# EAGLE design PayloadV13 (EAGLE 7.3.0)
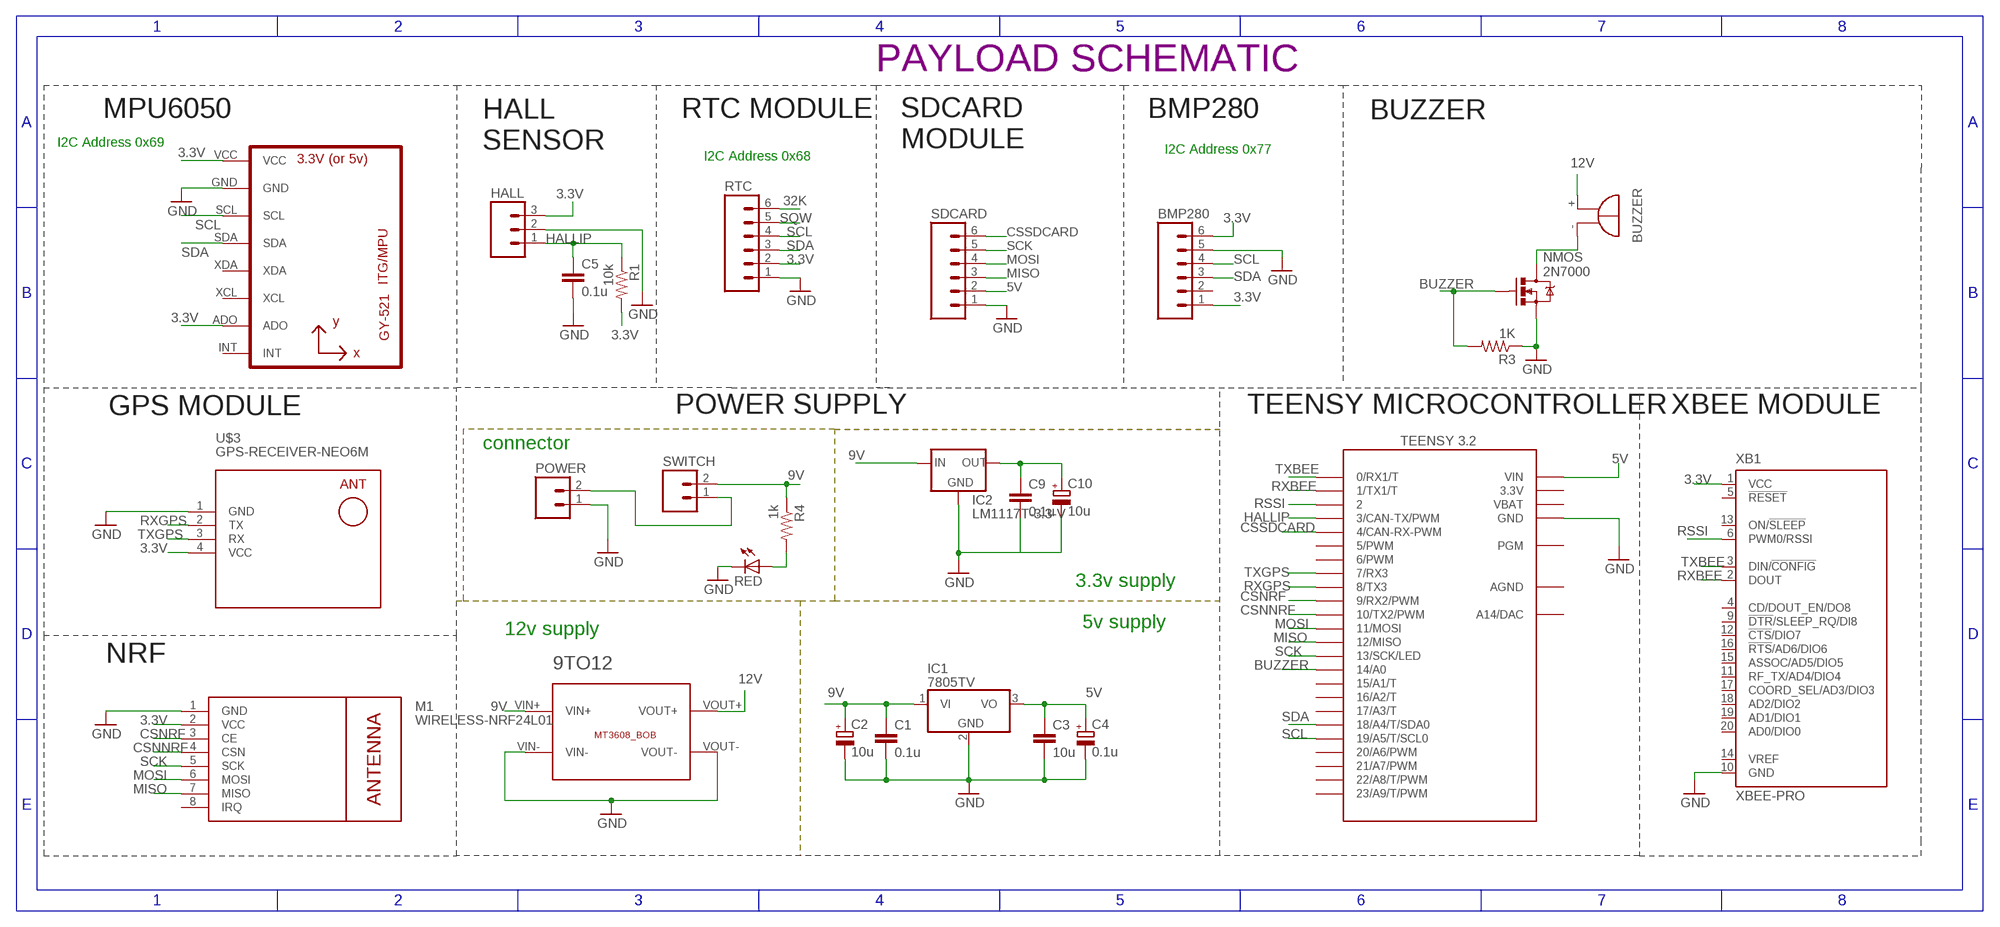
[diagram p0: schematic, sheet 1]

## Parts
9TO12  BREAKOUTS_MT3608_BOB  [BREAKOUTS_MT3608_BOB]
BMP280  M06  [06P]
C1  0.1u  C-EU025-025X050  [C025-025X050]
C2  10u  CPOL-EUE2.5-6  [E2,5-6]
C3  10u  C-EU025-025X050  [C025-025X050]
C4  0.1u  CPOL-EUE2.5-6  [E2,5-6]
C5  0.1u  C-EU025-025X050  [C025-025X050]
C9  0.1u  C-EU025-025X050  [C025-025X050]
C10  10u  CPOL-EUE2.5-6  [E2,5-6]
HALL  M03  [03P]
IC1  7805TV  [TO220V]
IC2  LM1117T-3.3-V  [TO220V]
M1  WIRELESS-NRF24L01  [WIRELESS-NRF24L01]
POWER  CEDT_JANUARY_2015_V5_M02  [CEDT_JANUARY_2015_V5_02P]
Q1  SPARKFUN-DISCRETESEMI_MOSFET-NCHANNEL2N7000  [SPARKFUN-DISCRETESEMI_TO-92]
R1  10k  R-US_0204/7  [0204/7]
R3  1K  R-US_0204/7  [0204/7]
R4  1k  R-US_0204/7  [0204/7]
RED  red  LED3MM  [LED3MM]
RTC  M06  [06P]
SDCARD  M06  [06P]
SG1  BUZZER_EB2209A  [BUZZER_EB2209A]
SWITCH  M02  [02P]
U1  GY-521MPU6050  [GY-521]
U$2  TEENSY_3.1-3.2_OUTER_ROW  [TEENSY_3.0-3.2&LC_OUTER_ROW]
U$3  GPS-RECEIVER-NEO6M  [GPS-RECEIVER-NEO6M]
XB1  XBEE-PRO  [XBEE-PRO]

## Nets
3.3V [power]: BMP280.1 BMP280.6 C9.1 C10.+ HALL.3 IC2.2(OUT) M1.2(VCC) R1.2 RTC.2 U1.ADO U1.VCC U$3.4(VCC) XB1.1(VCC)
5V [power]: C3.1 C4.+ IC1.3(VO) SDCARD.2 U$2.VIN
9V [power]: 9TO12.VIN+ C1.1 C2.+ IC1.1(VI) IC2.3(IN) R4.1 SWITCH.2
12V [power]: 9TO12.VOUT+ SG1.+
32K: RTC.6
BUZZER: Q1.2(G) R3.2 U$2.14/A0
CSNNRF: M1.4(CSN) U$2.10(10/TX2/PWM)
CSNRF: M1.3(CE) U$2.9(9/RX2/PWM)
CSSDCARD: SDCARD.6 U$2.4(4/CAN-RX-PWM)
GND [power]: 9TO12.VIN- 9TO12.VOUT- BMP280.5 C1.2 C2.- C3.2 C4.- C5.2 C9.2 C10.- HALL.2 IC1.2(GND) IC2.1(GND) M1.1(GND) POWER.1 Q1.1(S) R3.1 RED.K(C) RTC.1 SDCARD.1 U1.GND U$2.GND U$2.GND1(GND) U$3.1(GND) XB1.10(GND)
HALLIP: C5.1 HALL.1 R1.1 U$2.3(3/CAN-TX/PWM)
MISO: M1.7(MISO) SDCARD.3 U$2.12(12/MISO)
MOSI: M1.6(MOSI) SDCARD.4 U$2.11(11/MOSI)
N$1 [power]: POWER.2 SWITCH.1
N$2: R4.2 RED.A
N$3 [power]: Q1.3(D) SG1.-
RSSI: U$2.2 XB1.6(PWM0/RSSI)
RXBEE: U$2.1(1/TX1/T) XB1.2(DOUT)
RXGPS: U$2.8(8/TX3) U$3.2(TX)
SCK: M1.5(SCK) SDCARD.5 U$2.13(13/SCK/LED)
SCL: BMP280.4 RTC.4 U1.SCL U$2.19/A5(19/A5/T/SCL0)
SDA: BMP280.3 RTC.3 U1.SDA U$2.18/A4(18/A4/T/SDA0)
SQW: RTC.5
TXBEE: U$2.0(0/RX1/T) XB1.3(DIN/!CONFIG)
TXGPS: U$2.7(7/RX3) U$3.3(RX)
Unconnected: BMP280.2 M1.8(IRQ) U1.INT U1.XCL U1.XDA U$2.5(5/PWM) U$2.6(6/PWM) U$2.15/A1(15/A1/T) U$2.16/A2(16/A2/T) U$2.17/A3(17/A3/T) U$2.20/A6(20/A6/PWM) U$2.21/A7(21/A7/PWM) U$2.22/A8(22/A8/T/PWM) U$2.23/A9(23/A9/T/PWM) U$2.PGM U$2.RESET/DAC(A14/DAC) XB1.4(CD/DOUT_EN/DO8) XB1.5(!RESET) XB1.9(!DTR!/SLEEP_RQ/DI8) XB1.11(RF_TX/AD4/DIO4) XB1.12(!CTS!/DIO7) XB1.13(ON/!SLEEP) XB1.14(VREF) XB1.15(ASSOC/AD5/DIO5) XB1.16(!RTS!/AD6/DIO6) XB1.17(COORD_SEL/AD3/DIO3) XB1.18(AD2/DIO2) XB1.19(AD1/DIO1) XB1.20(AD0/DIO0)

## Notes on the sheet
- PAYLOAD SCHEMATIC
- MPU6050 | RTC MODULE | BMP280 | BUZZER
- I2C Address 0x69
- SDCARD
  MODULE
- HALL
  SENSOR
- I2C Address 0x77
- I2C Address 0x68
- GPS MODULE | POWER SUPPLY | TEENSY MICROCONTROLLER | XBEE MODULE
- connector
- 3.3v supply
- 5v supply
- 12v supply
- NRF

## Power pins joined to a net without a drawn wire
3.3V: U$2.3.3V U$2.3.3V1(3.3V)
AGND: U$2.AGND
VBAT: U$2.VBAT

## Library data of the parts
9TO12 = Cansat2019_3279_Container_v01:BREAKOUTS_MT3608_BOB
BMP280 RTC SDCARD = con-amp-quick:M06: AMP QUICK CONNECTOR; OC_FARNELL: unknown; OC_NEWARK: unknown
C1 C3 C5 C9 = resistor:C-EU: CAPACITOR, European symbol
C2 C4 C10 = rcl:CPOL-EU: POLARIZED CAPACITOR, European symbol
HALL = con-amp-quick:M03: AMP QUICK CONNECTOR; OC_FARNELL: unknown; OC_NEWARK: unknown
IC1 = linear:78*: Positive VOLTAGE REGULATOR Source: http://cache.national.com/ds/LM/LM78L05.pdf http://www.fairchildsemi.com/ds/LM/LM7805.pdf
IC2 = lm1117:LM1117T-*
M1 = diy-modules:WIRELESS-NRF24L01: 2.4 GHz Wireless Module based on NRF24L01 chip More details available here: http://www.electrodragon.com/w/NRF24L01 Click here to find device on ebay.com <http://www.ebay.com/sch/nrf24l01+arduino>
POWER = Cansat2019_3279_Container_v01:CEDT_JANUARY_2015_V5_M02: AMP QUICK CONNECTOR
Q1 = Cansat2019_3279_Container_v01:SPARKFUN-DISCRETESEMI_MOSFET-NCHANNEL: Common NMOSFET Parts MFG P/N Store ID Prod ID FDD8780 TRANS-09984 SI7820DN TRANS-11055 FDS6630A IC-08089 2N7002PW TRANS-11151 FQP30N06L COM-10213 TRANS-10060 BSS123LT1G TRANS-08345 BSS138 TRANS-00830 BS170 2N7000
R1 R3 R4 = rcl:R-US_: RESISTOR, American symbol
RED = CEDT_JANUARY_2015_v5:LED
SG1 = Cansat2019_3279_Container_v01:BUZZER_EB2209A: BUZZER Source: Buerklin; OC_FARNELL: unknown; OC_NEWARK: unknown
SWITCH = CEDT_JANUARY_2015_v5:M02: AMP QUICK CONNECTOR
U1 = gy-521:GY-521
U$2 = Teensy_3_and_LC_Series_Boards_v1.4:TEENSY_3.1-3.2_OUTER_ROW: Footprint for Teensy 3.1 or 3.2 board using all pin connections on the outer perimeter
U$3 = diy-modules_modded_gps:GPS-RECEIVER-NEO6M: GPS Receiver Module based on NEO-6 device Short tutorial how to use NEO-6 module with Arduino: http://www.xarg.org/2016/06/neo6mv2-gps-module-with-arduino/ NEO-6 datasheet is available here: https://www.u-blox.com/sites/default/files/products/documents/NEO-6_DataSheet_%28GPS.G6-HW-09005%29.pdf Click here to find device on ebay.com <http://www.ebay.com/sch/gyneo6mv2>
XB1 = maxstream:XBEE: XBee (TM) /XBee-PRO(TM) OEM RF Modules Source: MaxStream, Inc. xbee_productmanual.pdf; MPN: XBP24-AWI-001; OC_FARNELL: 1337916; OC_NEWARK: 42M2667

## Net classes
0 default: width 0.406 mm
1 power: width 0.61 mm

## Board
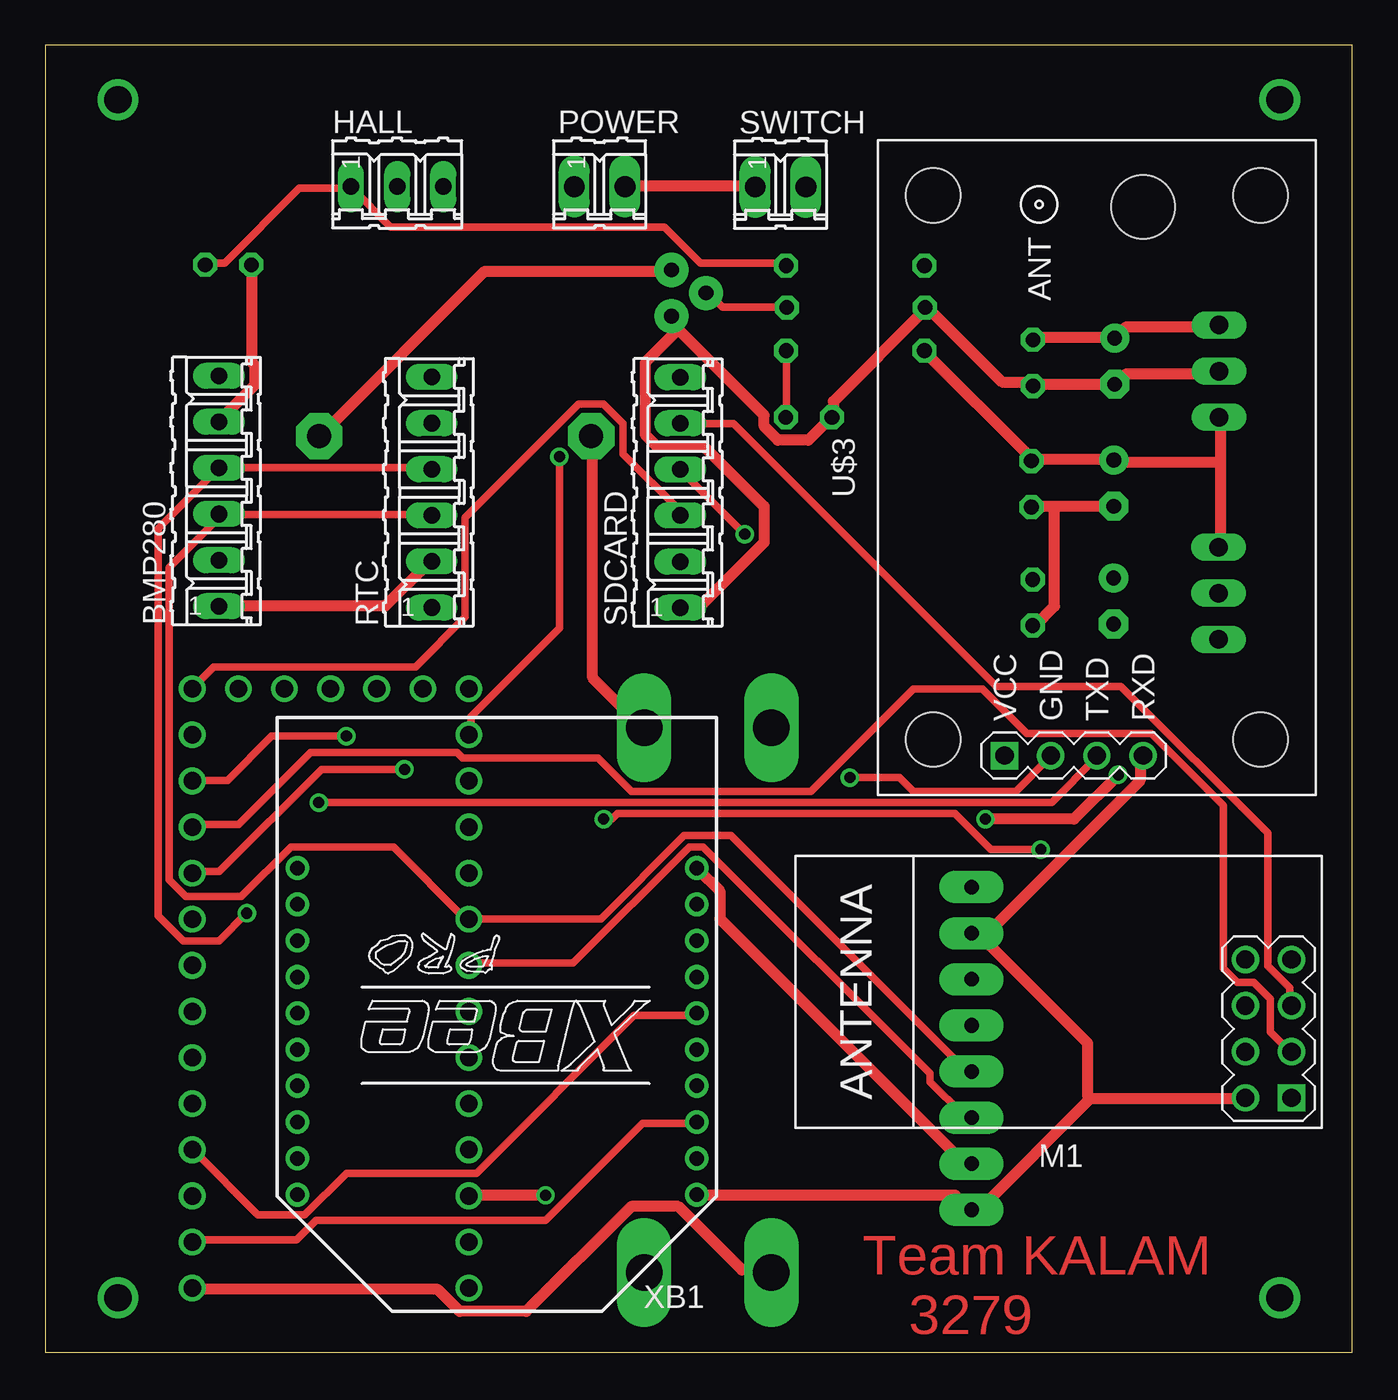
[diagram p1: board, top side]
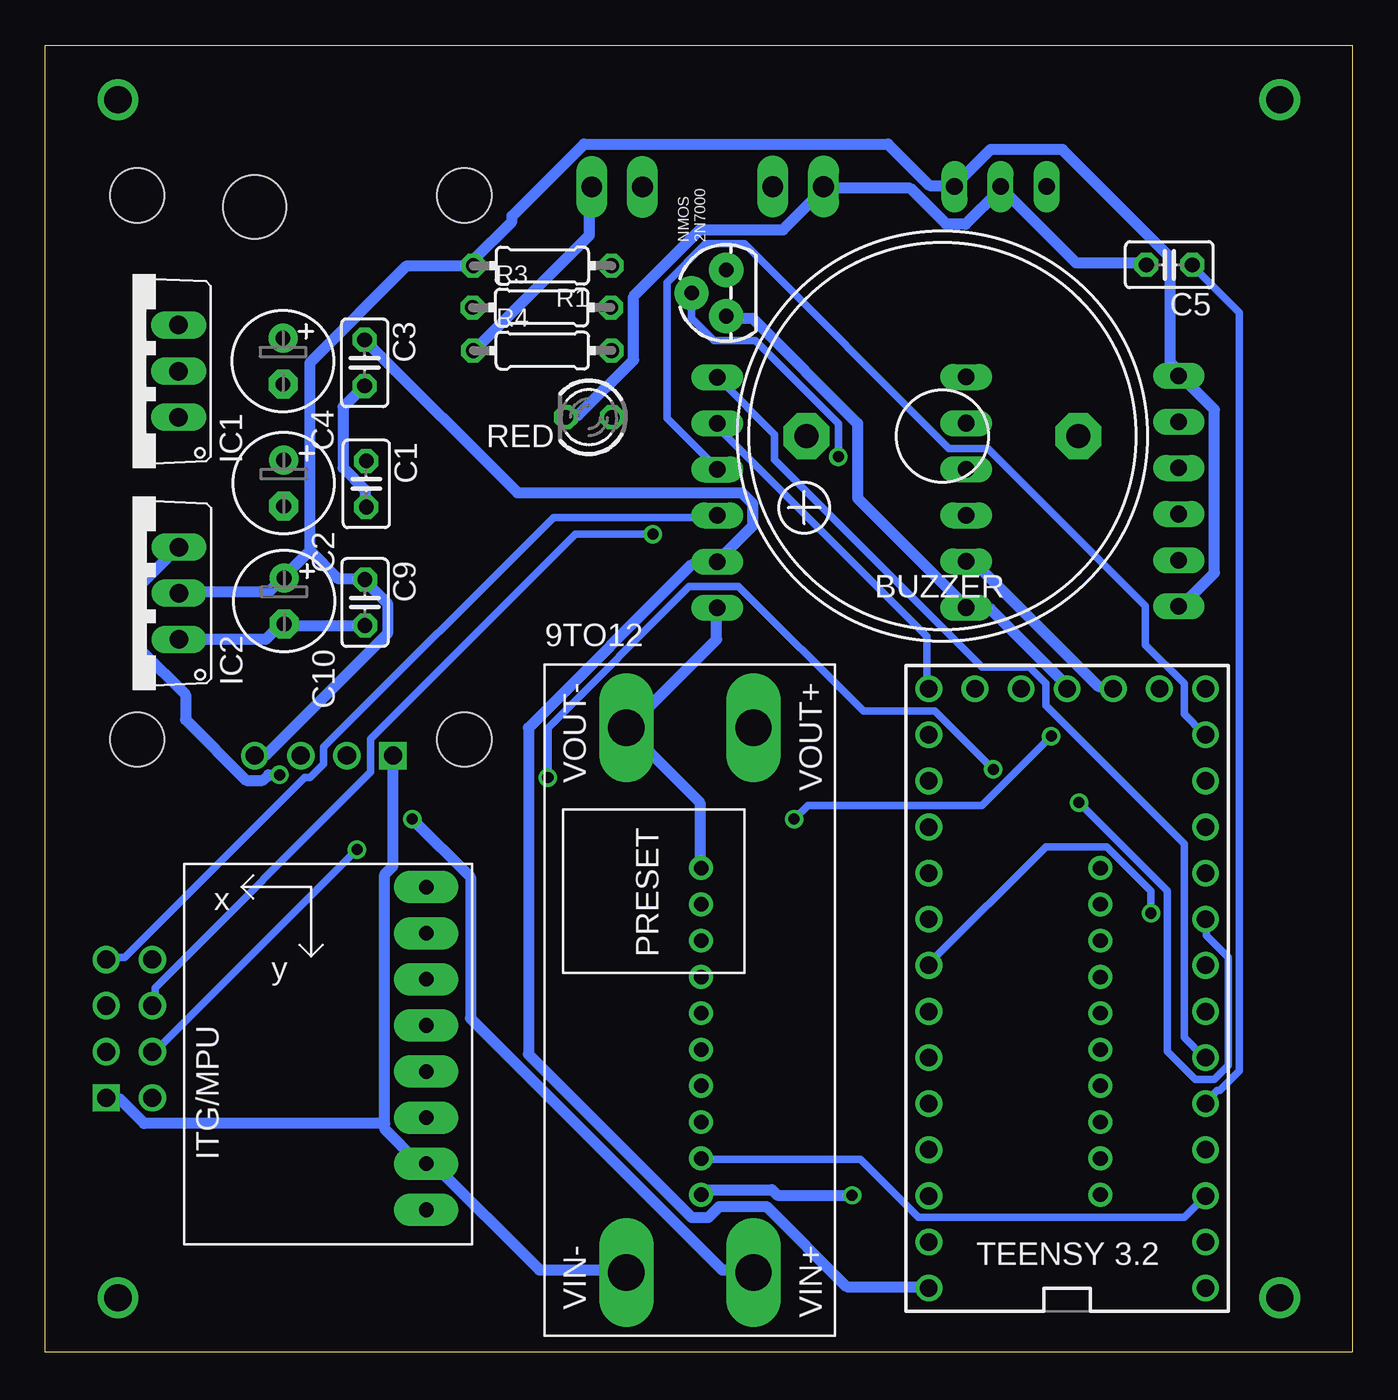
[diagram p2: board, bottom side, seen from below]

Size 72 x 72 mm. Coordinates in mm from the lower left corner, seen from the top.
Outline: 0,0 72,0 72,72 0,72 0,0
Copper layers (1*16): Top 0.035mm / dielectric 1.5mm / Bottom 0.035mm
Design rules "default": minimum track width 10mil, minimum drill 24mil, track to track 8mil, track to pad 8mil, pad to pad 8mil, via to via 8mil, smd to smd 8mil, copper to edge 40mil, drill to drill 8mil, minimum pad ring 10mil, minimum via ring 8mil, stop-mask expansion 4mil, vias tented up to drill 0mil, thermal gap 10mil

### Footprints (pad centres in the part's own frame; a part is rotated, then mirrored left to right if it is on the bottom)
BREAKOUTS_MT3608_BOB = drill 2 pad 3 long: VIN+ 33.5,-4.5; VIN- 33.5,-11.5; VOUT+ 3.5,-4.5; VOUT- 3.5,-11.5
06P = drill 0.914 long: 1 -6.35,0; 2 -3.81,0; 3 -1.27,0; 4 1.27,0; 5 3.81,0; 6 6.35,0
C025-025X050 = drill 0.813 octagon: 1 -1.27,0; 2 1.27,0
E2,5-6 = drill 0.813 pad 1.6: + -1.27,0 | drill 0.813 pad 1.6 octagon: - 1.27,0
03P = drill 0.914 long: 1 -2.54,0; 2 0,0; 3 2.54,0
TO220V = drill 1.016 long: 1 -2.54,-2.54; 2 0,-2.54; 3 2.54,-2.54
WIRELESS-NRF24L01 = drill 1 square: 1 -12.7,6.35 | drill 1: 2 -10.16,6.35; 3 -12.7,3.81; 4 -10.16,3.81; 5 -12.7,1.27; 6 -10.16,1.27; 7 -12.7,-1.27; 8 -10.16,-1.27
CEDT_JANUARY_2015_V5_02P = drill 1.143 long: 1 -1.397,0; 2 1.397,0
SPARKFUN-DISCRETESEMI_TO-92 = drill 0.813 pad 1.88: 1 -1.27,0; 2 0,1.905; 3 1.27,0
0204/7 = drill 0.813 octagon: 1 -3.81,0; 2 3.81,0
LED3MM = drill 0.813 octagon: A -1.27,0; K 1.27,0
BUZZER_EB2209A = drill 1.321 pad 2.54 octagon: + 7.493,0; - -7.493,0
02P = drill 1.143 long: 1 -1.397,0; 2 1.397,0
GY-521 = drill 0.8 pad 1.778 long: ADO -8.89,-6.35; GND -8.89,6.35; INT -8.89,-8.89; SCL -8.89,3.81; SDA -8.89,1.27; VCC -8.89,8.89; XCL -8.89,-3.81; XDA -8.89,-1.27
TEENSY_3.0-3.2&LC_OUTER_ROW = drill 0.965: 0 -7.62,13.97; 1 -7.62,11.43; 2 -7.62,8.89; 3 -7.62,6.35; 3.3V 7.62,11.43; 3.3V1 -2.54,-16.51; 4 -7.62,3.81; 5 -7.62,1.27; 6 -7.62,-1.27; 7 -7.62,-3.81; 8 -7.62,-6.35; 9 -7.62,-8.89; 10 -7.62,-11.43; 11 -7.62,-13.97; 12 -7.62,-16.51; 13 7.62,-16.51; 14/A0 7.62,-13.97; 15/A1 7.62,-11.43; 16/A2 7.62,-8.89; 17/A3 7.62,-6.35; 18/A4 7.62,-3.81; 19/A5 7.62,-1.27; 20/A6 7.62,1.27; 21/A7 7.62,3.81; 22/A8 7.62,6.35; 23/A9 7.62,8.89; AGND 7.62,13.97; GND -7.62,16.51; GND1 0,-16.51; PGM 2.54,-16.51; RESET/DAC 5.08,-16.51; VBAT -5.08,-16.51; VIN 7.62,16.51
GPS-RECEIVER-NEO6M = drill 1 square: 1 -15.875,5.08 | drill 1: 2 -15.875,2.54; 3 -15.875,0; 4 -15.875,-2.54 | hole 3: -14.986,9.017; -14.986,-9.017; 14.986,-9.017; 14.986,9.017 | hole 3.5: 14.351,-2.54
XBEE-PRO = drill 0.8 pad 1.27: 1 -11,9; 2 -11,7; 3 -11,5; 4 -11,3; 5 -11,1; 6 -11,-1; 7 -11,-3; 8 -11,-5; 9 -11,-7; 10 -11,-9; 11 11,-9; 12 11,-7; 13 11,-5; 14 11,-3; 15 11,-1; 16 11,1; 17 11,3; 18 11,5; 19 11,7; 20 11,9

### Placement (x,y rotation side)
9TO12  28.49,37.9 270 bottom
BMP280  9.56,47.45 90 top
C1  54.32,47.84 270 bottom
C2  58.87,47.88 270 bottom
C3  54.41,54.51 270 bottom
C4  58.91,54.6 270 bottom
C5  10.08,59.91 180 bottom
C9  54.4,41.3 270 bottom
C10  58.85,41.38 270 bottom
HALL  19.38,64.22 0 top
IC1  67.2,54.05 90 bottom
IC2  67.18,41.82 90 bottom
M1  55.95,20.37 180 top
POWER  30.53,64.22 0 top
Q1  34.49,58.36 90 bottom
R1  44.62,59.86 180 bottom
R3  44.66,57.56 0 bottom
R4  44.62,55.19 0 bottom
RED  42.06,51.51 180 bottom
RTC  21.28,47.38 90 top
SDCARD  34.98,47.37 90 top
SG1  22.58,50.47 180 bottom
SWITCH  40.5,64.2 0 top
U1  59.91,16.74 180 bottom
U$2  15.71,20.05 180 bottom
U$3  57.93,48.75 90 top
XB1  24.88,17.68 180 top

### Tracks (layer width: path | path; a pad name or v marks a point on that pad's centre or on a via)
3.3V  (via drill 0.61)
  Top 0.61: XB1.1 35.94,8.65 50.11,8.65 50.87,7.89 U1.VCC 51.33,7.89 51.48,7.89 57.58,13.98 | v27.55,8.65 23.44,8.65 U$2.3.3V | 57.58,13.98 65.96,13.98 M1.2 | 57.58,13.98 57.43,14.14 57.43,17.03 51.48,22.98 51.02,22.98 U1.ADO 51.79,22.98 60.32,31.51 60.32,32.73 U$3.4 | BMP280.1 9.57,41.11 18.72,41.11 21.15,43.55 RTC.2
  Bottom 0.61: v27.55,8.65 31.67,8.65 31.98,8.95 35.63,8.95 35.78,8.8 XB1.1 | BMP280.1 9.42,41.11 7.59,42.94 7.59,51.93 9.42,53.76 BMP280.6 9.57,54.06 10.03,54.52 10.03,60.31 15.97,66.26 19.93,66.26 21.92,64.28 HALL.3 22.22,64.28 23.29,64.28 25.57,66.56 42.34,66.56 46.3,62.6 46.3,62.29 48.43,60.16 R1.2 52.09,59.86 57.43,54.52 57.43,44.16 | U$2.3.3V1 13.23,36.69 13.99,36.69 20.85,43.55 21.15,43.55 RTC.2 | 57.43,44.16 58.8,42.79 C10.+ 59.1,42.48 59.71,41.87 64.59,41.87 IC2.2 | 57.43,44.16 55.9,42.63 54.53,42.63 C9.1 54.23,42.33 53.16,41.26 53.16,39.59 59.86,32.88 60.32,32.88 U$3.4
5V
  Top 0.61: C3.1 54.53,55.89 58.8,55.89 C4.+ 59.1,56.05 59.56,56.5 64.59,56.5 IC1.3
  Bottom 0.61: C3.1 54.38,55.74 46,47.36 33.65,47.36 33.04,46.75 33.04,45.53 34.87,43.7 SDCARD.2 35.17,43.4 36.39,43.4 45.39,34.41 45.39,16.42 36.39,7.43 35.48,7.43 34.87,8.04 32.28,8.04 27.86,3.62 23.44,3.62 U$2.VIN
9V  (via drill 0.61)
  Top 0.61: 64.74,49.03 64.74,51.47 IC1.1 | 64.74,49.03 64.74,44.46 IC2.3 | R4.1 48.43,55.13 54.23,49.34 C1.1 54.38,49.19 58.8,49.19 C2.+ 59.1,49.03 64.74,49.03 | v51.79,29.38 56.66,29.38 v59.1,31.81
  Bottom 0.61: SWITCH.2 42.03,64.12 42.03,61.53 48.28,55.28 R4.1 | v51.79,29.38 48.59,26.18 48.59,18.4 34.72,4.53 33.04,4.53 9TO12.VIN+ | v59.1,31.81 59.71,31.81 60.02,31.51 60.93,31.51 64.28,34.86 64.28,36.23 66.72,38.67 66.72,42.33 64.74,44.31 IC2.3
12V
  Top 0.61: SG1.+ 30.15,50.41 30.15,37.15 32.89,34.41 9TO12.VOUT+
BUZZER  (via drill 0.61)
  Top 0.406: R3.2 40.81,57.57 37.31,57.57 36.55,58.33 Q1.2 | v28.32,49.34 28.32,39.89 23.44,35.01 23.44,34.1 U$2.14/A0
  Bottom 0.406: v28.32,49.34 28.32,51.17 32.89,55.74 35.17,55.74 36.39,56.96 36.39,58.33 Q1.2
CSNNRF  (via drill 0.61)
  Top 0.406: v16.58,33.95 12.47,33.95 10.03,31.51 8.2,31.51 U$2.10 | v30.76,29.38 31.21,29.38 31.52,29.68 50.11,29.68 52.09,27.7 v54.84,27.7
  Bottom 0.406: v16.58,33.95 20.39,30.14 29.99,30.14 v30.76,29.38 | v54.84,27.7 65.96,16.57 M1.4
CSNRF
  Top 0.406: U$2.9 8.2,29.07 10.64,29.07 14.6,33.03 22.68,33.03 22.98,32.73 30.45,32.73 32.28,30.9 42.19,30.9 47.82,36.54 51.63,36.54 54.07,34.1 60.93,34.1 64.89,30.14 64.89,21.15 65.66,20.38 66.57,20.38 67.48,19.47 67.48,17.64 68.55,16.57 M1.3
CSSDCARD
  Bottom 0.406: SDCARD.6 34.87,53.61 31.82,50.56 31.82,49.19 20.39,37.76 17.8,37.76 16.89,36.84 16.89,35.62 9.27,28 9.27,17.34 8.2,16.27 U$2.4
GND
  Top 0.61: U$2.GND 8.2,3.47 21.61,3.47 22.83,2.25 26.49,2.25 32.28,8.04 34.87,8.04 38.38,4.53 39.9,4.53 9TO12.VIN- | C5.2 11.4,59.86 11.4,54.52 11.55,54.37 11.55,53.3 9.57,51.32 BMP280.5 | 55.6,46.6 58.8,46.6 C2.- | 55.6,46.6 54.38,46.6 C1.2 | 55.6,46.6 55.6,41.11 54.53,40.04 C9.2 | IC1.2 64.59,53.91 59.56,53.91 59.1,53.45 C4.- 58.8,53.3 54.53,53.3 C3.2 54.23,53.45 52.7,53.45 48.74,57.42 R3.1 48.43,57.42 43.41,52.39 43.41,51.63 RED.K 43.1,51.32 42.03,50.25 40.36,50.25 39.59,51.02 39.59,51.63 34.57,56.66 34.57,56.96 Q1.1 34.72,56.2 33.04,54.52 33.04,50.56 33.65,49.95 36.24,49.95 39.59,46.6 39.59,44.62 36.09,41.11 35.02,41.11 SDCARD.1 | U1.GND 50.87,10.48 50.57,10.48 37.16,23.89 37.16,25.41 35.94,26.63 XB1.10
  Bottom 0.61: 53.31,12.61 53.31,12.31 51.48,10.48 51.02,10.48 U1.GND 50.72,10.48 44.78,4.53 40.05,4.53 9TO12.VIN- | 53.31,12.61 53.31,26.33 52.85,26.79 52.85,32.73 U$3.1 | 53.31,12.61 66.57,12.61 67.94,13.98 68.55,13.98 M1.1 | C5.2 11.4,60.01 15.21,60.01 19.33,64.12 HALL.2 19.48,63.97 21.31,62.14 22.37,62.14 24.36,64.12 29.08,64.12 POWER.1 29.23,63.97 31.36,61.84 35.94,61.84 39.59,58.18 39.59,54.67 42.64,51.63 43.25,51.63 RED.K | XB1.10 35.94,26.79 35.94,30.29 39.9,34.25 9TO12.VOUT- 39.75,34.56 35.02,39.28 35.02,40.96 SDCARD.1 | C9.2 54.53,40.04 58.8,40.04 C10.- 59.1,40.04 59.86,39.28 64.59,39.28 IC2.1 | U$2.GND1 15.67,36.69 19.93,40.96 21.15,40.96 RTC.1 21.46,41.26 27.25,47.05 27.25,51.17 33.04,56.96 34.41,56.96 Q1.1 | C1.2 54.38,46.6 54.38,47.51 55.6,48.73 55.6,52.08 54.53,53.15 C3.2
HALLIP
  Top 0.406: C5.1 8.81,60.01 9.88,60.01 13.99,64.12 16.73,64.12 HALL.1 16.89,64.12 19.02,61.99 34.11,61.99 36.09,60.01 40.66,60.01 R1.1
  Bottom 0.406: U$2.3 8.05,13.83 7.44,14.44 7.29,14.44 6.22,15.51 6.22,57.27 8.81,59.86 C5.1
MISO
  Top 0.406: SDCARD.3 34.87,46.14 34.87,46.44 31.82,49.49 31.82,51.17 30.76,52.24 29.38,52.24 23.14,45.99 23.14,40.5 20.39,37.76 9.27,37.76 8.2,36.69 U$2.12
  Bottom 0.406: M1.7 68.55,21.76 67.64,21.76 57.73,31.66 57.43,31.66 56.66,32.42 56.66,33.34 44.01,45.99 35.02,45.99 SDCARD.3
MOSI  (via drill 0.61)
  Top 0.406: v38.53,45.07 35.02,48.58 SDCARD.4
  Bottom 0.406: SDCARD.4 35.02,48.73 37.77,51.47 37.77,58.94 35.63,61.08 33.5,61.08 22.22,49.8 20.09,49.8 11.4,41.11 11.4,38.98 9.27,36.84 9.27,35.17 8.2,34.1 U$2.11 | v38.53,45.07 42.8,45.07 54.07,33.8 54.07,31.97 65.96,20.08 65.96,19.16 M1.6
N$1
  Top 0.61: SWITCH.1 38.98,64.28 31.98,64.28 POWER.2
N$2
  Top 0.406: RED.A 40.81,51.63 40.81,55.13 R4.2
N$3
  Top 0.61: Q1.3 34.41,59.55 24.2,59.55 15.21,50.56 SG1.-
N$4  (via drill 1.5)
  other vias: 4,69
N$5  (via drill 1.5)
  other vias: 4,3
N$7  (via drill 1.5)
  other vias: 68,69
N$8  (via drill 1.5)
  other vias: 68,3
RSSI
  Top 0.406: XB1.6 35.78,18.55 32.43,18.55 23.75,9.87 16.58,9.87 14.3,7.58 11.71,7.58 8.2,11.09 U$2.2
RXBEE
  Bottom 0.406: XB1.2 35.78,10.63 27.1,10.63 23.9,7.43 9.27,7.43 8.2,8.5 U$2.1
RXGPS  (via drill 0.61)
  Top 0.406: v19.78,32.12 15.21,32.12 9.57,26.48 8.2,26.48 U$2.8 | v44.32,31.66 47.06,31.66 47.82,30.9 53.46,30.9 55.29,32.73 U$3.2
  Bottom 0.406: v19.78,32.12 22.98,35.32 26.95,35.32 33.8,42.18 36.55,42.18 44.32,34.41 v44.32,31.66
SCK
  Top 0.406: M1.5 68.55,19.16 68.55,20.08 67.33,21.3 67.33,28.61 59.25,36.69 52.4,36.69 37.92,51.17 35.02,51.17 SDCARD.5
  Bottom 0.406: SDCARD.5 34.87,51.17 34.87,50.86 23.44,39.43 23.44,36.69 U$2.13
SCL  (via drill 0.61)
  Top 0.406: RTC.4 21.15,48.73 9.57,48.73 BMP280.4 9.42,48.58 6.22,45.38 6.22,24.04 7.59,22.67 9.57,22.67 v11.1,24.19 | U$2.19/A5 23.44,21.45 29.08,21.45 35.48,27.85 36.24,27.85 48.74,15.36 48.74,14.9 50.57,13.07 50.87,13.07 U1.SCL
  Bottom 0.406: v11.1,24.19 11.1,25.41 13.53,27.85 16.89,27.85 23.29,21.45 U$2.19/A5
SDA
  Top 0.406: RTC.3 21.15,46.14 9.57,46.14 BMP280.3 9.57,45.99 6.83,43.24 6.83,26.02 7.74,25.11 10.79,25.11 13.53,27.85 19.17,27.85 23.14,23.89 U$2.18/A4 23.44,23.89 30.6,23.89 35.17,28.46 37.77,28.46 50.87,15.36 U1.SDA
TXBEE
  Top 0.406: XB1.3 35.78,12.61 32.89,12.61 27.55,7.28 14.91,7.28 13.84,6.21 8.2,6.21 U$2.0
TXGPS  (via drill 0.61)
  Top 0.406: v15.06,30.29 55.44,30.29 57.88,32.73 U$3.3
  Bottom 0.406: v15.06,30.29 10.18,25.41 10.18,16.57 8.66,15.05 7.59,15.05 6.83,15.81 6.83,21.76 8.05,22.98 8.05,23.74 U$2.7

### Text on the board
Top: Team KALAM / 3279
tStop: Team KALAM / 3279